# EAGLE design Protoboard (EAGLE 7.4.0)
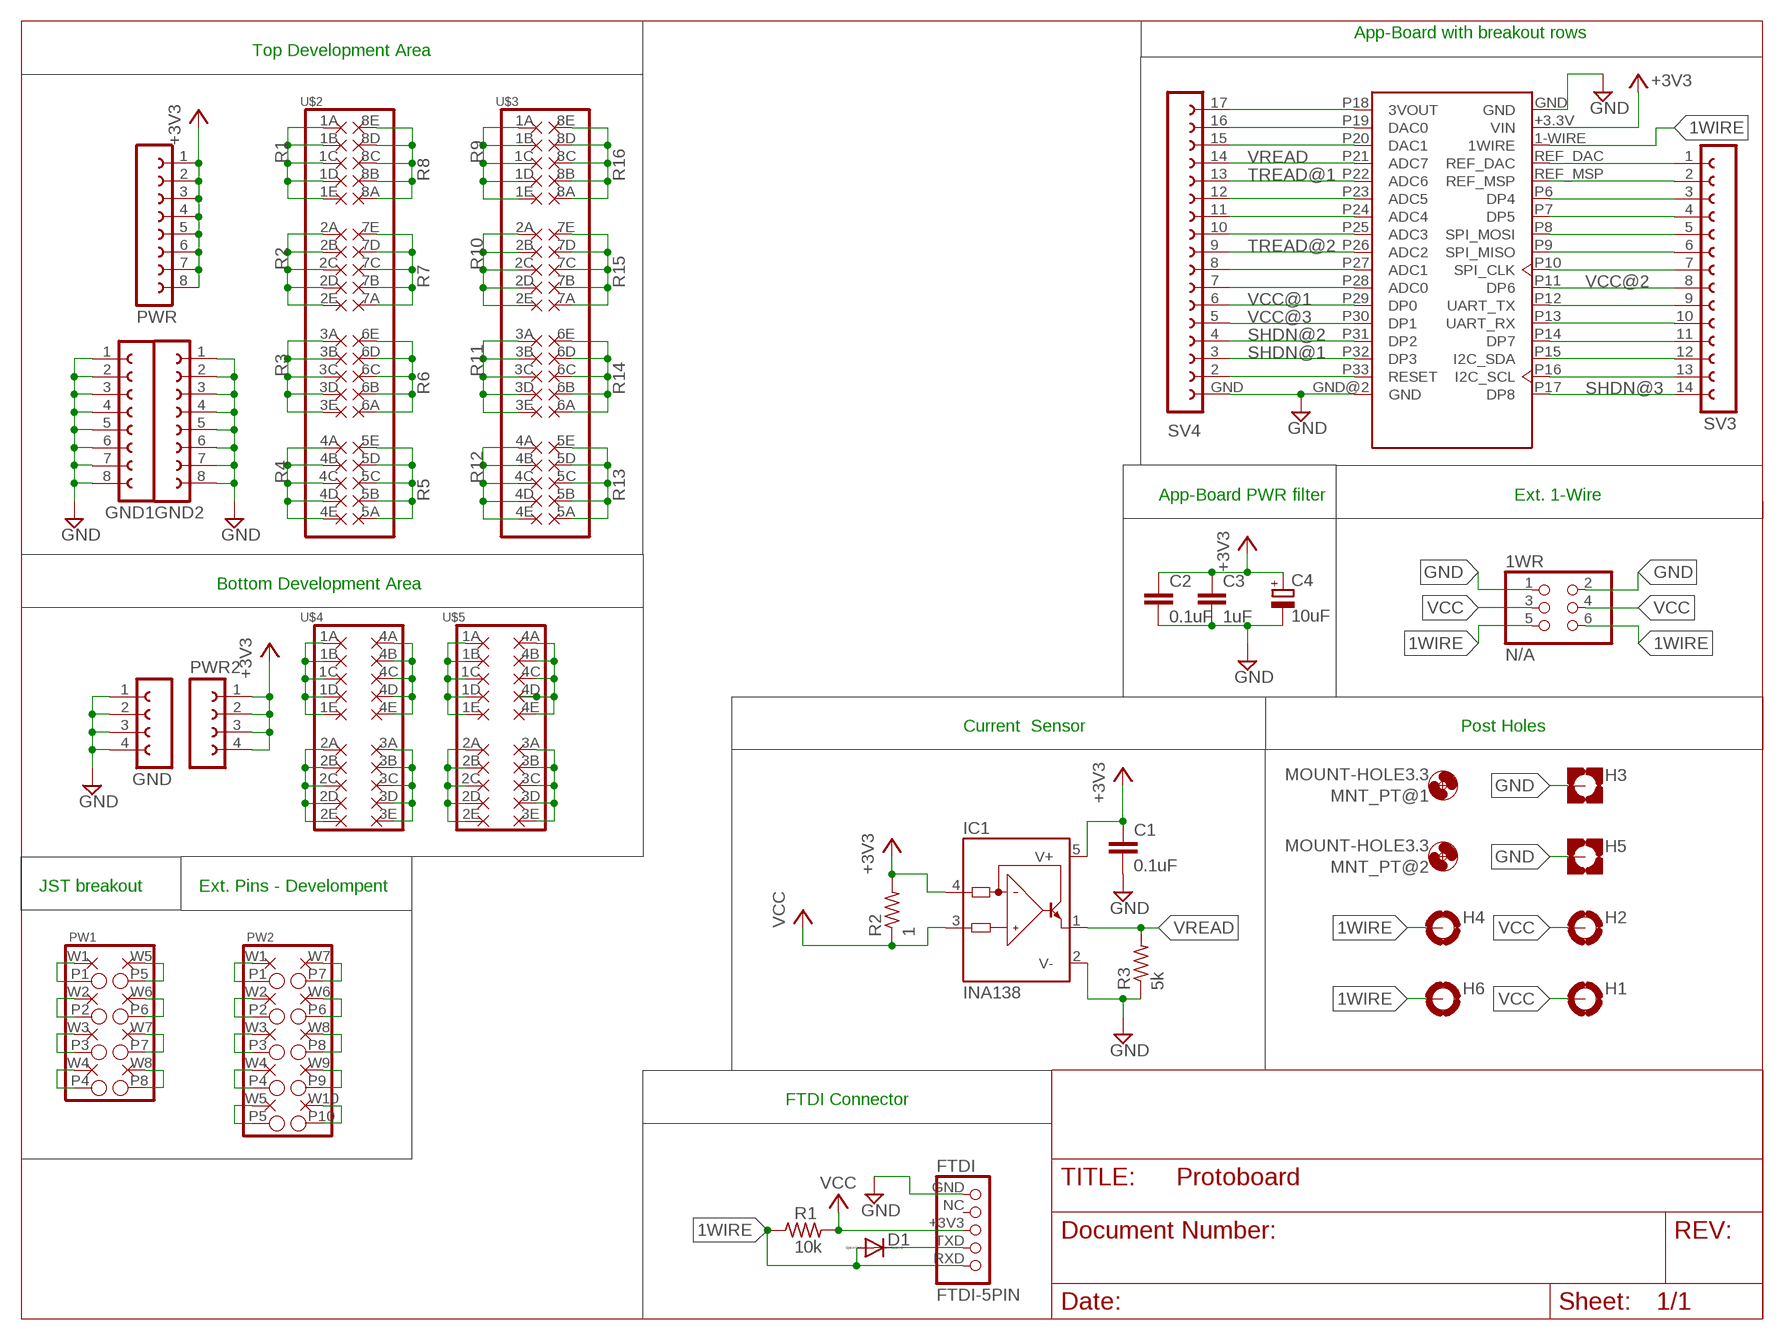
[diagram p0: schematic, sheet 1]

## Parts
1WR  N/A  PINHD-2X3  [2X03]
C1  0.1uF  C-EUC0603  [C0603]
C2  0.1uF  C-EUC0603  [C0603]
C3  1uF  C-EUC0603  [C0603]
C4  10uF  CPOL-EUSMCB  [SMC_B]
D1  1N4148DO35-7  [DO35-7]
FTDI  FTDI-5PIN  [1X05]
GND  FE04-1-GND  [FE04-GND]
GND1  FE08-1-GND  [FE08-GND]
GND2  FE08-1-GND  [FE08-GND]
H1  MOUNT-PAD-ROUND3.3  [3,3-PAD]
H2  MOUNT-PAD-ROUND3.3  [3,3-PAD]
H3  MOUNT-PAD-SQUARE3.3  [3,3-PAD-SQUARE]
H4  MOUNT-PAD-ROUND3.3  [3,3-PAD]
H5  MOUNT-PAD-SQUARE3.3  [3,3-PAD-SQUARE]
H6  MOUNT-PAD-ROUND3.3  [3,3-PAD]
IC1  INA138  [SOT23-5]
MNT_PT@1  MOUNT-HOLE3.3  [3,3]
MNT_PT@2  MOUNT-HOLE3.3  [3,3]
PW1  PIN-WIRE-2X8  [2X8]
PW2  PIN-WIRE-2X10  [2X10]
PWR  FE08-1  [FE08]
PWR2  FE04-1  [FE04-1]
R1  10k  R-US_0204/5  [0204/5]
R2  1  R-US_R0603  [R0603]
R3  5k  R-US_R0805  [R0805]
SV3  FE14-1_ABBO  [FE14-1_ABBO]
SV4  FE17-1_ABBO  [FE17-1_ABBO]
U$1  App-Board 1.2/1.3  APP_CORE  [APPCORE_RECEIVER]
U$2  PROTO-5X8  [PROTO-5X08]
U$3  PROTO-5X8  [PROTO-5X08]
U$4  PROTO-4X5  [PROTO-4X05]
U$5  PROTO-4X5  [PROTO-4X05]

## Nets
1WIRE: 1WR.5 1WR.6 D1.A FTDI.RXD H4.B3,3(MOUNT) H6.B3,3(MOUNT) R1.1 U$1.1-WIRE(1WIRE)
+3V3: C1.1 C2.1 C3.1 C4.+ IC1.4(IN-) IC1.5(V+) PWR2.1 PWR2.2 PWR2.3 PWR2.4 PWR.1 PWR.2 PWR.3 PWR.4 PWR.5 PWR.6 PWR.7 PWR.8 R2.2 U$1.+3.3V(VIN)
GND: 1WR.1 1WR.2 C1.2 C2.2 C3.2 C4.- FTDI.GND GND1.1 GND1.2 GND1.3 GND1.4 GND1.5 GND1.6 GND1.7 GND1.8 GND2.1 GND2.2 GND2.3 GND2.4 GND2.5 GND2.6 GND2.7 GND2.8 GND.1 GND.2 GND.3 GND.4 H3.B3,3(MOUNT) H5.B3,3(MOUNT) IC1.2(V-) R3.1 SV4.GND U$1.GND U$1.GND@2(GND)
N$1: U$4.1A U$4.1B U$4.1C U$4.1D U$4.1E
N$2: PW1.P1 PW1.W1(W$1)
N$3: D1.C FTDI.TXD
N$4: PW1.P2 PW1.W2(W$2)
N$5: U$4.4A U$4.4B U$4.4C U$4.4D U$4.4E
N$6: U$4.2A U$4.2B U$4.2C U$4.2D U$4.2E
N$7: U$4.3A U$4.3B U$4.3C U$4.3D U$4.3E
N$8: U$5.1A U$5.1B U$5.1C U$5.1D U$5.1E
N$9: U$5.4A U$5.4B U$5.4C U$5.4D U$5.4E
N$10: U$5.2A U$5.2B U$5.2C U$5.2D U$5.2E
N$11: U$5.3A U$5.3B U$5.3C U$5.3D U$5.3E
N$12: PW2.P1 PW2.W1(W$1)
N$13: PW2.P2 PW2.W2(W$2)
N$14: PW2.P3 PW2.W3(W$3)
N$15: PW2.P4 PW2.W4(W$4)
N$16: PW2.P5 PW2.W5(W$5)
N$17: PW2.P7 PW2.W7(W$7)
N$18: PW2.P6 PW2.W6(W$6)
N$19: PW2.P8 PW2.W8(W$8)
N$20: PW2.P9 PW2.W9(W$9)
N$21: PW2.P10 PW2.W10(W$10)
N$22: SV3.1 U$1.REF_DAC
N$23: SV3.2 U$1.REF_MSP
N$24: SV3.3 U$1.P6(DP4)
N$25: SV3.4 U$1.P7(DP5)
N$26: SV3.5 U$1.P8(SPI_MOSI)
N$27: SV3.6 U$1.P9(SPI_MISO)
N$28: SV3.7 U$1.P10(SPI_CLK)
N$29: SV3.9 U$1.P12(UART_TX)
N$30: SV3.10 U$1.P13(UART_RX)
N$31: SV3.11 U$1.P14(DP7)
N$32: SV3.12 U$1.P15(I2C_SDA)
N$33: SV3.13 U$1.P16(I2C_SCL)
N$34: SV4.17 U$1.P18(3VOUT)
N$35: SV4.16 U$1.P19(DAC0)
N$36: SV4.15 U$1.P20(DAC1)
N$37: SV4.12 U$1.P23(ADC5)
N$38: SV4.11 U$1.P24(ADC4)
N$39: SV4.10 U$1.P25(ADC3)
N$40: SV4.8 U$1.P27(ADC1)
N$41: SV4.7 U$1.P28(ADC0)
N$42: PW1.P3 PW1.W3(W$3)
N$43: PW1.P4 PW1.W4(W$4)
N$44: PW1.P5 PW1.W5(W$5)
N$45: PW1.P6 PW1.W6(W$6)
N$46: PW1.P7 PW1.W7(W$7)
N$47: PW1.P8 PW1.W8(W$8)
R1: U$2.1A U$2.1B U$2.1C U$2.1D U$2.1E
R2: U$2.2A U$2.2B U$2.2C U$2.2D U$2.2E
R3: U$2.3A U$2.3B U$2.3C U$2.3D U$2.3E
R4: U$2.4A U$2.4B U$2.4C U$2.4D U$2.4E
R5: U$2.5A U$2.5B U$2.5C U$2.5D U$2.5E
R6: U$2.6A U$2.6B U$2.6C U$2.6D U$2.6E
R7: U$2.7A U$2.7B U$2.7C U$2.7D U$2.7E
R8: U$2.8A U$2.8B U$2.8C U$2.8D U$2.8E
R9: U$3.1A U$3.1B U$3.1C U$3.1D U$3.1E
R10: U$3.2A U$3.2B U$3.2C U$3.2D U$3.2E
R11: U$3.3A U$3.3B U$3.3C U$3.3D U$3.3E
R12: U$3.4A U$3.4B U$3.4C U$3.4D U$3.4E
R13: U$3.5A U$3.5B U$3.5C U$3.5D U$3.5E
R14: U$3.6A U$3.6B U$3.6C U$3.6D U$3.6E
R15: U$3.7A U$3.7B U$3.7C U$3.7D U$3.7E
R16: U$3.8A U$3.8B U$3.8C U$3.8D U$3.8E
RESET: SV4.2 U$1.P33(RESET)
SHDN@1: SV4.3 U$1.P32(DP3)
SHDN@2: SV4.4 U$1.P31(DP2)
SHDN@3: SV3.14 U$1.P17(DP8)
TREAD@1: SV4.13 U$1.P22(ADC6)
TREAD@2: SV4.9 U$1.P26(ADC2)
VCC: 1WR.3 1WR.4 FTDI.+3V3 H1.B3,3(MOUNT) H2.B3,3(MOUNT) IC1.3(IN+) R1.2 R2.1
VCC@1: SV4.6 U$1.P29(DP0)
VCC@2: SV3.8 U$1.P11(DP6)
VCC@3: SV4.5 U$1.P30(DP1)
VREAD: IC1.1(OUT) R3.2 SV4.14 U$1.P21(ADC7)
Unconnected: FTDI.NC

## Notes on the sheet
- App-Board with breakout rows
- Top Development Area
- App-Board PWR filter | Ext. 1-Wire
- Bottom Development Area
- Current  Sensor | Post Holes
- JST breakout | Ext. Pins - Develompent
- FTDI Connector

## Library data of the parts
1WR = pinhead:PINHD-2X3: PIN HEADER
C1-C3 = resistor:C-EU: CAPACITOR, European symbol
C4 = resistor:CPOL-EU: POLARIZED CAPACITOR, European symbol
D1 = diode:1N4148: DIODE high speed (Philips)
FTDI = FTDI:FTDI-5PIN
GND = prototyping_holes:FE04-1-GND: FEMALE HEADER
GND1 GND2 = prototyping_holes:FE08-1-GND: FEMALE HEADER; OC_FARNELL: unknown; OC_NEWARK: unknown
H1 H2 H4 H6 = holes:MOUNT-PAD-ROUND: MOUNTING PAD, round
H3 H5 = holes:MOUNT-PAD-SQUARE: MOUNTING PAD, square
IC1 = burr-brown:INA138: High-Side Measurement Current Shunt Monitor; MF: TEXAS INSTRUMENTS; MPN: INA138NA/250; OC_FARNELL: 1564888; OC_NEWARK: 80K5906
MNT_PT@1 MNT_PT@2 = holes:MOUNT-HOLE: MOUNTING HOLE with drill center marker
PW1 = prototyping_holes:PIN-WIRE-2X8
PW2 = prototyping_holes:PIN-WIRE-2X10
PWR = con-lsta:FE08-1: FEMALE HEADER; OC_FARNELL: unknown; OC_NEWARK: unknown
PWR2 = prototyping_holes:FE04-1: FEMALE HEADER
R1-R3 = resistor:R-US_: RESISTOR, American symbol
SV3 = prototyping_holes:FE14-1_ABBO: FEMALE HEADER
SV4 = prototyping_holes:FE17-1_ABBO: FEMALE HEADER
U$1 = LearningByMaking2:APP_CORE
U$2 U$3 = prototyping_holes:PROTO-5X8
U$4 U$5 = prototyping_holes:PROTO-4X5

## Board
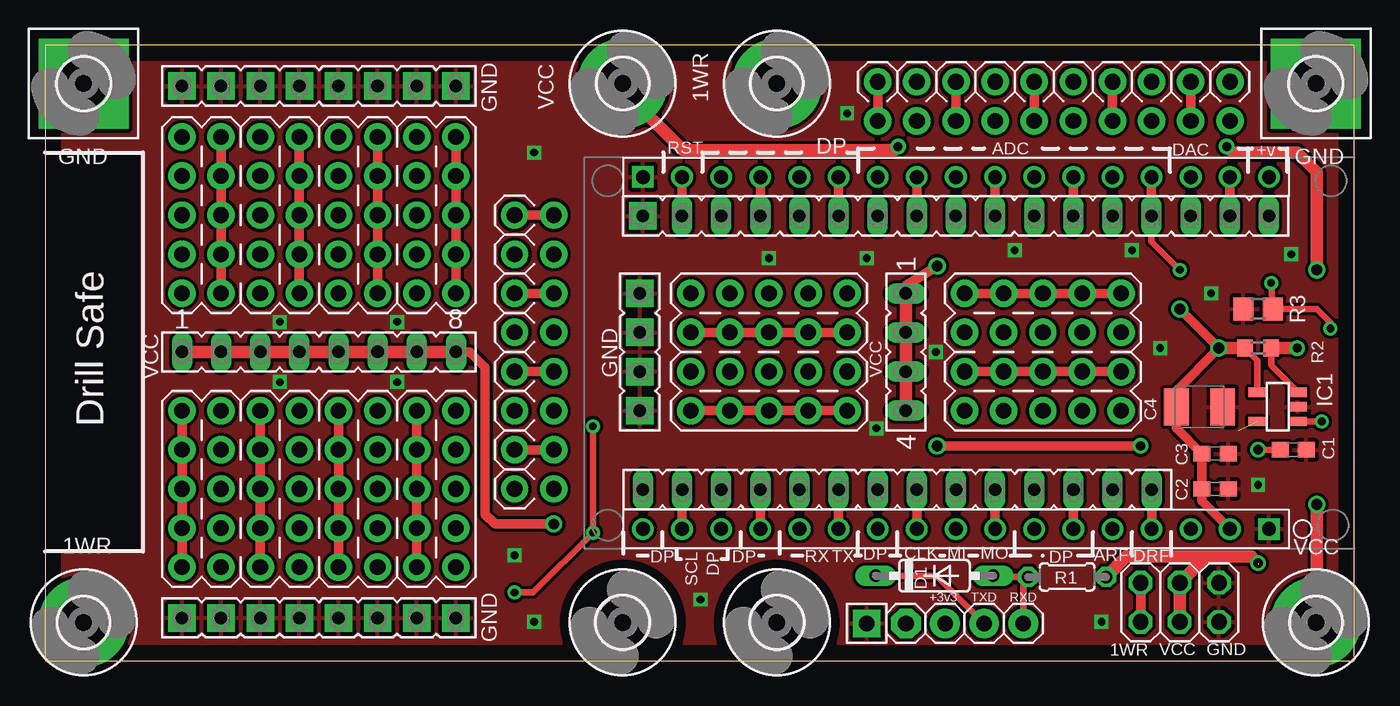
[diagram p1: board, top side]
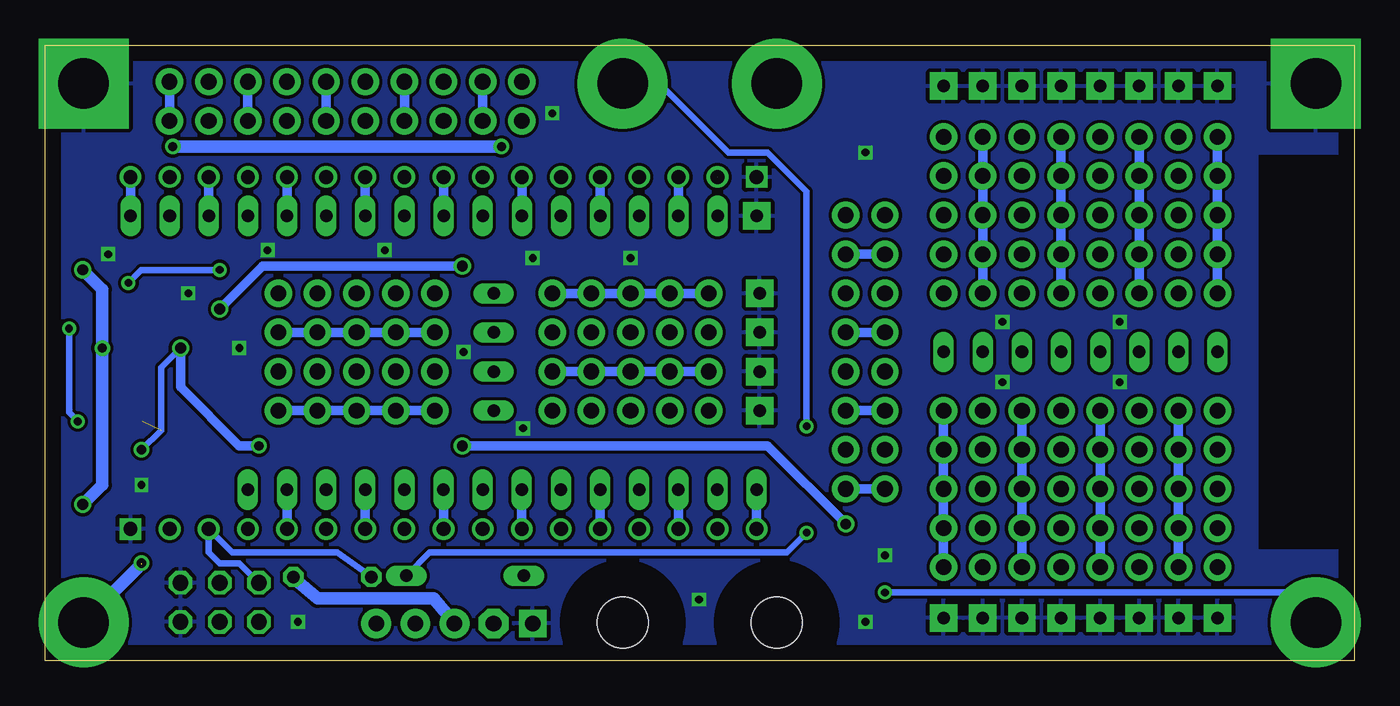
[diagram p2: board, bottom side, seen from below]

Size 85 x 40 mm. Coordinates in mm from the lower left corner, seen from the top.
Outline: 0,0 85,0 85,40 0,40 0,0
Copper layers (1*16): Top 0.035mm / dielectric 1.5mm / Bottom 0.035mm
Design rules "default *": minimum track width 10mil, minimum drill 19mil, track to track 8mil, track to pad 8mil, pad to pad 8mil, via to via 8mil, smd to smd 8mil, copper to edge 40mil, drill to drill 8mil, minimum pad ring 10mil, minimum via ring 8mil, stop-mask expansion 4mil, vias tented up to drill 0mil, thermal gap 10mil

### Footprints (pad centres in the part's own frame; a part is rotated, then mirrored left to right if it is on the bottom)
2X03 = drill 1.016 octagon: 1 -2.54,-1.27; 2 -2.54,1.27; 3 0,-1.27; 4 0,1.27; 5 2.54,-1.27; 6 2.54,1.27
C0603 = smd 1.1 x 1: 1 -0.85,0; 2 0.85,0
SMC_B = smd 1.6 x 2.4: + -1.5,0; - 1.5,0
DO35-7 = drill 0.813 long: A 3.81,0; C -3.81,0
1X05 = drill 1.016 pad 1.93: +3V3 0,0; RXD 5.08,0; TXD 2.54,0 | drill 1.016 pad 1.778 square: GND -5.08,0 | drill 1.016 pad 1.93 octagon: NC -2.54,0
FE04-GND = drill 0.813 pad 1.778 square: 1 -3.81,0; 2 -1.27,0; 3 1.27,0; 4 3.81,0
FE08-GND = drill 0.813 pad 1.778 square: 1 -8.89,0; 2 -6.35,0; 3 -3.81,0; 4 -1.27,0; 5 1.27,0; 6 3.81,0; 7 6.35,0; 8 8.89,0
3,3-PAD = drill 3.3 pad 5.842: B3,3 0,0
3,3-PAD-SQUARE = drill 3.3 pad 5.842 square: B3,3 0,0
SOT23-5 = smd 0.6 x 1.2: 1 -0.95,-1.306; 2 0,-1.306; 3 0.95,-1.306; 4 0.95,1.306; 5 -0.95,1.306
3,3 = hole 3.3: 0,0
2X8 = drill 1.016 pad 1.778: P1 -8.89,1.27; P2 -6.35,1.27; P3 -3.81,1.27; P4 -1.27,1.27; P5 1.27,1.27; P6 3.81,1.27; P7 6.35,1.27; P8 8.89,1.27; W1 -8.89,-1.27; W2 -6.35,-1.27; W3 -3.81,-1.27; W4 -1.27,-1.27; W5 1.27,-1.27; W6 3.81,-1.27; W7 6.35,-1.27; W8 8.89,-1.27
2X10 = drill 1.016 pad 1.778: P1 -11.43,1.27; P2 -8.89,1.27; P3 -6.35,1.27; P4 -3.81,1.27; P5 -1.27,1.27; P6 1.27,1.27; P7 3.81,1.27; P8 6.35,1.27; P9 8.89,1.27; P10 11.43,1.27; W1 -11.43,-1.27; W2 -8.89,-1.27; W3 -6.35,-1.27; W4 -3.81,-1.27; W5 -1.27,-1.27; W6 1.27,-1.27; W7 3.81,-1.27; W8 6.35,-1.27; W9 8.89,-1.27; W10 11.43,-1.27
FE08 = drill 0.813 long: 1 -8.89,0; 2 -6.35,0; 3 -3.81,0; 4 -1.27,0; 5 1.27,0; 6 3.81,0; 7 6.35,0; 8 8.89,0
FE04-1 = drill 0.813 long: 1 -5.08,0; 2 -2.54,0; 3 0,0; 4 2.54,0
0204/5 = drill 0.813 octagon: 1 -2.54,0; 2 2.54,0
R0603 = smd 1 x 1.1: 1 -0.85,0; 2 0.85,0
R0805 = smd 1.3 x 1.5: 1 -0.95,0; 2 0.95,0
FE14-1_ABBO = drill 0.813 long: 1 -17.78,0; 2 -15.24,0; 3 -12.7,0; 4 -10.16,0; 5 -7.62,0; 6 -5.08,0; 7 -2.54,0; 8 0,0; 9 2.54,0; 10 5.08,0; 11 7.62,0; 12 10.16,0; 13 12.7,0; 14 15.24,0
FE17-1_ABBO = drill 0.813 long: 2 -15.24,0; 3 -12.7,0; 4 -10.16,0; 5 -7.62,0; 6 -5.08,0; 7 -2.54,0; 8 0,0; 9 2.54,0; 10 5.08,0; 11 7.62,0; 12 10.16,0; 13 12.7,0; 14 15.24,0; 15 17.78,0; 16 20.32,0; 17 22.86,0 | drill 0.813 pad 1.778 square: GND -17.78,0
APPCORE_RECEIVER = drill 0.9: 1-WIRE 11.43,14.37; +3.3V 11.43,16.91; P6 11.43,6.75; P7 11.43,4.21; P8 11.43,1.67; P9 11.43,-0.87; P10 11.43,-3.41; P11 11.43,-5.95; P12 11.43,-8.49; P13 11.43,-11.03; P14 11.43,-13.57; P15 11.43,-16.11; P16 11.43,-18.65; P17 11.43,-21.19; P18 -11.43,19.45; P19 -11.43,16.91; P20 -11.43,14.37; P21 -11.43,11.83; P22 -11.43,9.29; P23 -11.43,6.75; P24 -11.43,4.21; P25 -11.43,1.67; P26 -11.43,-0.87; P27 -11.43,-3.41; P28 -11.43,-5.95; P29 -11.43,-8.49; P30 -11.43,-11.03; P31 -11.43,-13.57; P32 -11.43,-16.11; P33 -11.43,-18.65; REF_DAC 11.43,11.83; REF_MSP 11.43,9.29 | drill 0.9 square: GND 11.43,19.45; GND@2 -11.43,-21.19
PROTO-5X08 = drill 1.016 pad 1.778: 1A -5.08,8.89; 1B -2.54,8.89; 1C 0,8.89; 1D 2.54,8.89; 1E 5.08,8.89; 2A -5.08,6.35; 2B -2.54,6.35; 2C 0,6.35; 2D 2.54,6.35; 2E 5.08,6.35; 3A -5.08,3.81; 3B -2.54,3.81; 3C 0,3.81; 3D 2.54,3.81; 3E 5.08,3.81; 4A -5.08,1.27; 4B -2.54,1.27; 4C 0,1.27; 4D 2.54,1.27; 4E 5.08,1.27; 5A -5.08,-1.27; 5B -2.54,-1.27; 5C 0,-1.27; 5D 2.54,-1.27; 5E 5.08,-1.27; 6A -5.08,-3.81; 6B -2.54,-3.81; 6C 0,-3.81; 6D 2.54,-3.81; 6E 5.08,-3.81; 7A -5.08,-6.35; 7B -2.54,-6.35; 7C 0,-6.35; 7D 2.54,-6.35; 7E 5.08,-6.35; 8A -5.08,-8.89; 8B -2.54,-8.89; 8C 0,-8.89; 8D 2.54,-8.89; 8E 5.08,-8.89
PROTO-4X05 = drill 1.016 pad 1.778: 1A -3.81,5.08; 1B -3.81,2.54; 1C -3.81,0; 1D -3.81,-2.54; 1E -3.81,-5.08; 2A -1.27,5.08; 2B -1.27,2.54; 2C -1.27,0; 2D -1.27,-2.54; 2E -1.27,-5.08; 3A 1.27,5.08; 3B 1.27,2.54; 3C 1.27,0; 3D 1.27,-2.54; 3E 1.27,-5.08; 4A 3.81,5.08; 4B 3.81,2.54; 4C 3.81,0; 4D 3.81,-2.54; 4E 3.81,-5.08

### Placement (x,y rotation side)
1WR  73.66,3.81 180 top
C1  81.03,13.72 0 top
C2  75.95,11.18 0 top
C3  75.95,13.46 0 top
C4  74.93,16.51 0 top
D1  57.73,5.54 0 top
FTDI  58.42,2.44 0 top
GND  38.61,20.07 90 top
GND1  17.78,37.34 0 top
GND2  17.78,2.79 0 top
H1  82.5,2.5 0 top
H2  37.5,37.5 0 top
H3  82.5,37.5 0 top
H4  47.5,37.5 0 top
H5  2.5,37.5 0 top
H6  2.5,2.5 0 top
IC1  80.01,16.51 90 top
MNT_PT@1  47.5,2.5 0 top
MNT_PT@2  37.5,2.5 0 top
PW1  31.75,20.07 90 top
PW2  65.48,36.35 0 top
PWR  17.78,20.07 0 top
PWR2  55.88,18.8 270 top
R1  66.34,5.46 0 top
R2  78.74,20.32 180 top
R3  78.74,22.86 0 top
SV3  54.05,11.13 180 top
SV4  56.59,28.91 0 top
U$1  60,20 270 top
U$2  17.78,28.96 270 top
U$3  17.78,11.18 270 top
U$4  64.77,20.07 270 top
U$5  46.99,20.07 270 top

### Tracks (layer width: path | path; a pad name or v marks a point on that pad's centre or on a via)
1WIRE  (via drill 0.5)
  Top 0.406: v35.56,15.24 v35.56,8.33 31.67,4.45 v30.48,4.45 | D1.A 61.62,5.46 R1.1 63.5,5.16 FTDI.RXD
  Top 0.61: 1WR.6 1WR.5
  Bottom 0.406: H6.B3,3 3.73,4.45 v30.48,4.45 | v35.56,15.24 35.56,30.48 38.1,33.02 40.64,33.02 45.12,37.5 H4.B3,3 | v35.56,8.33 36.83,7.06 60.02,7.06 D1.A | R1.1 66.04,7.06 72.86,7.06 U$1.1-WIRE 74.37,7.06 73.66,6.35 72.39,6.35 1WR.5
+3V3  (via drill 0.6, 0.7)  (1 unrouted)
  Top 0.406: IC1.4 78.7,19.51 R2.2 | C1.1 v78.74,13.72
  Top 0.61: 26.92,20.07 PWR.8 27.56,20.07 28.57,19.05 28.57,9.53 29.21,8.89 v33.02,8.89 | v57.91,13.97 v71.12,13.97 | 55.88,24.13 55.88,24.38 v57.91,25.65 | v73.66,22.86 v76.2,20.32 73.43,17.55 C4.+ 73.43,15.13 C3.1 C2.1 75.1,10.38 U$1.+3.3V
  Top 0.813: PWR.1 PWR.2 PWR.3 PWR.4 PWR.5 PWR.6 PWR.7 PWR.8 | v76.2,20.32 R2.2 | PWR2.4 PWR2.3 PWR2.2 PWR2.1 55.88,24.13
  Bottom 0.406: v76.2,20.32 77.47,19.05 77.47,14.99 v78.74,13.72
  Bottom 0.61: v57.91,13.97 38.1,13.97 v33.02,8.89 | v57.91,25.65 70.87,25.65 v73.66,22.86 | v76.2,20.32 76.2,17.78 72.39,13.97 v71.12,13.97
GND  (via drill 0.5)
  other vias: 31.75,33.02 46.99,26.16 30.48,6.86 42.55,3.99 72.39,20.32 75.69,23.88 80.9,26.42 62.94,26.67 53.98,15.11 57.84,20.07 22.86,18.11 15.24,22.02 31.75,2.54 52.07,35.56 78.74,11.43 68.58,2.54 15.24,18.11 22.86,22.02 53.34,26.16 70.56,26.67
  pour Top: 0,0 0,7.11 6.35,7.11 6.35,33.02 0,33.02 0,40 85,40 85,0
  pour Bottom: 0,0 0,7.11 6.35,7.11 6.35,33.02 0,33.02 0,40 85,40 85,0
N$1
  Top 0.61: U$4.1E U$4.1D U$4.1C U$4.1B U$4.1A
N$2
  Bottom 0.61: PW1.W1 PW1.P1
N$3
  Top 0.406: FTDI.TXD 57.86,5.54 D1.C
N$4
  Top 0.61: PW1.W2 PW1.P2
N$5
  Bottom 0.61: U$4.4E U$4.4D U$4.4C U$4.4B U$4.4A
N$6
  Bottom 0.61: U$4.2A U$4.2B U$4.2C U$4.2D U$4.2E
N$7
  Top 0.61: U$4.3E U$4.3D U$4.3C U$4.3B U$4.3A
N$8
  Bottom 0.61: U$5.1A U$5.1B U$5.1C U$5.1D U$5.1E
N$9
  Top 0.61: U$5.4A U$5.4B U$5.4C U$5.4D U$5.4E
N$10
  Top 0.61: U$5.2E U$5.2D U$5.2C U$5.2B U$5.2A
N$11
  Bottom 0.61: U$5.3A U$5.3B U$5.3C U$5.3D U$5.3E
N$12
  Top 0.61: PW2.P1 PW2.W1
N$13
  Bottom 0.61: PW2.W2 PW2.P2
N$14
  Top 0.61: PW2.P3 PW2.W3
N$15
  Bottom 0.61: PW2.W4 PW2.P4
N$16
  Top 0.61: PW2.P5 PW2.W5
N$17
  Top 0.61: PW2.P7 PW2.W7
N$18
  Bottom 0.61: PW2.W6 PW2.P6
N$19
  Bottom 0.61: PW2.W8 PW2.P8
N$20
  Top 0.61: PW2.P9 PW2.W9
N$21
  Bottom 0.61: PW2.W10 PW2.P10
N$22
  Top 0.61: SV3.1 U$1.REF_DAC
N$23
  Bottom 0.61: SV3.2 U$1.REF_MSP
N$24
  Top 0.61: SV3.3 U$1.P6
N$25
  Bottom 0.61: SV3.4 U$1.P7
N$26
  Top 0.61: SV3.5 U$1.P8
N$27
  Bottom 0.61: SV3.6 U$1.P9
N$28
  Top 0.61: SV3.7 U$1.P10
N$29
  Top 0.61: SV3.9 U$1.P12
N$30
  Bottom 0.61: SV3.10 U$1.P13
N$31
  Top 0.61: SV3.11 U$1.P14
N$32
  Bottom 0.61: SV3.12 U$1.P15
N$33
  Top 0.61: SV3.13 U$1.P16
N$34
  Bottom 0.61: SV4.17 U$1.P18
N$35
  Top 0.61: SV4.16 U$1.P19
N$36
  Bottom 0.61: SV4.15 U$1.P20
N$37
  Top 0.61: SV4.12 U$1.P23
N$38
  Bottom 0.61: SV4.11 U$1.P24
N$39
  Top 0.61: U$1.P25 SV4.10
N$40
  Top 0.61: U$1.P27 SV4.8
N$41
  Bottom 0.61: SV4.7 U$1.P28
N$42
  Bottom 0.61: PW1.W3 PW1.P3
N$43
  Top 0.61: PW1.W4 PW1.P4
N$44
  Bottom 0.61: PW1.W5 PW1.P5
N$45
  Top 0.61: PW1.W6 PW1.P6
N$46
  Bottom 0.61: PW1.W7 PW1.P7
N$47
  Top 0.61: PW1.P8 PW1.W8
R1
  Top 0.61: U$2.1A U$2.1B U$2.1C U$2.1D U$2.1E
R2
  Bottom 0.61: U$2.2A U$2.2B U$2.2C U$2.2D U$2.2E
R3
  Top 0.61: U$2.3A U$2.3B U$2.3C U$2.3D U$2.3E
R4
  Bottom 0.61: U$2.4A U$2.4B U$2.4C U$2.4D U$2.4E
R5
  Top 0.61: U$2.5A U$2.5B U$2.5C U$2.5D U$2.5E
R6
  Bottom 0.61: U$2.6A U$2.6B U$2.6C U$2.6D U$2.6E
R7
  Top 0.61: U$2.7A U$2.7B U$2.7C U$2.7D U$2.7E
R8
  Bottom 0.61: U$2.8A U$2.8B U$2.8C U$2.8D U$2.8E
R9
  Bottom 0.61: U$3.1E U$3.1D U$3.1C U$3.1B U$3.1A
R10
  Top 0.61: U$3.2E U$3.2D U$3.2C U$3.2B U$3.2A
R11
  Bottom 0.61: U$3.3E U$3.3D U$3.3C U$3.3B U$3.3A
R12
  Top 0.61: U$3.4A U$3.4B U$3.4C U$3.4D U$3.4E
R13
  Bottom 0.61: U$3.5E U$3.5D U$3.5C U$3.5B U$3.5A
R14
  Top 0.61: U$3.6A U$3.6B U$3.6C U$3.6D U$3.6E
R15
  Bottom 0.61: U$3.7A U$3.7B U$3.7C U$3.7D U$3.7E
R16
  Top 0.61: U$3.8A U$3.8B U$3.8C U$3.8D U$3.8E
RESET  (1 unrouted)
  Top 0.61: U$1.P33 SV4.2
SHDN@1
  Bottom 0.61: U$1.P32 SV4.3
SHDN@2
  Top 0.61: SV4.4 U$1.P31
SHDN@3
  Bottom 0.61: U$1.P17 SV3.14
TREAD@1
  Bottom 0.61: SV4.13 U$1.P22
TREAD@2
  Bottom 0.61: SV4.9 U$1.P26
VCC  (via drill 0.6, 0.7)  (1 unrouted)
  Top 0.406: IC1.3 79.59,19.19 R2.1
  Top 0.813: 1WR.4 1WR.3 75.36,6.78 | v82.55,25.4 82.55,31.75 81.28,33.02 77.09,33.02 v76.71,33.4 | 75.36,6.78 78.31,6.78 v78.74,6.35 | v82.55,10.16 82.55,2.55 H1.B3,3 | R1.2 70.21,6.78 75.36,6.78 | v81.28,20.32 R2.1 | H2.B3,3 37.5,37.07 41.4,33.17 55.14,33.17 v55.37,33.4
  Bottom 0.813: v55.37,33.4 v76.71,33.4 | v82.55,25.4 81.28,24.13 v81.28,20.32 81.28,11.43 v82.55,10.16 | FTDI.+3V3 59.79,4.06 67.31,4.06 68.89,5.38 R1.2 | 78.74,6.26 H1.B3,3
VCC@1
  Top 0.61: SV4.6 U$1.P29
VCC@2
  Bottom 0.61: SV3.8 U$1.P11
VCC@3
  Bottom 0.61: SV4.5 U$1.P30
VREAD  (via drill 0.5)
  Top 0.406: v79.59,24.55 R3.2 82.55,22.86 83.44,21.97 v83.44,21.59 | SV4.14 71.83,27.23 v73.66,25.4 | IC1.1 v82.87,15.56
  Top 0.61: U$1.P21 SV4.14
  Bottom 0.406: v79.59,24.55 78.74,25.4 v73.66,25.4 | v83.44,21.59 83.44,16.13 v82.87,15.56

### Text on the board
tPlace: RST | DP | ADC | DAC | +v | SCL | DP | DP | CLK | MI | MO | ARF | DP | DP | RX | TX | DP | DRF
tNames: GND | VCC | 1WR | GND | GND | VCC | VCC | Drill Safe | 1WR | VCC | GND | VCC | GND